# EAGLE design OnOfre_2ADSP (EAGLE 8.6.0)
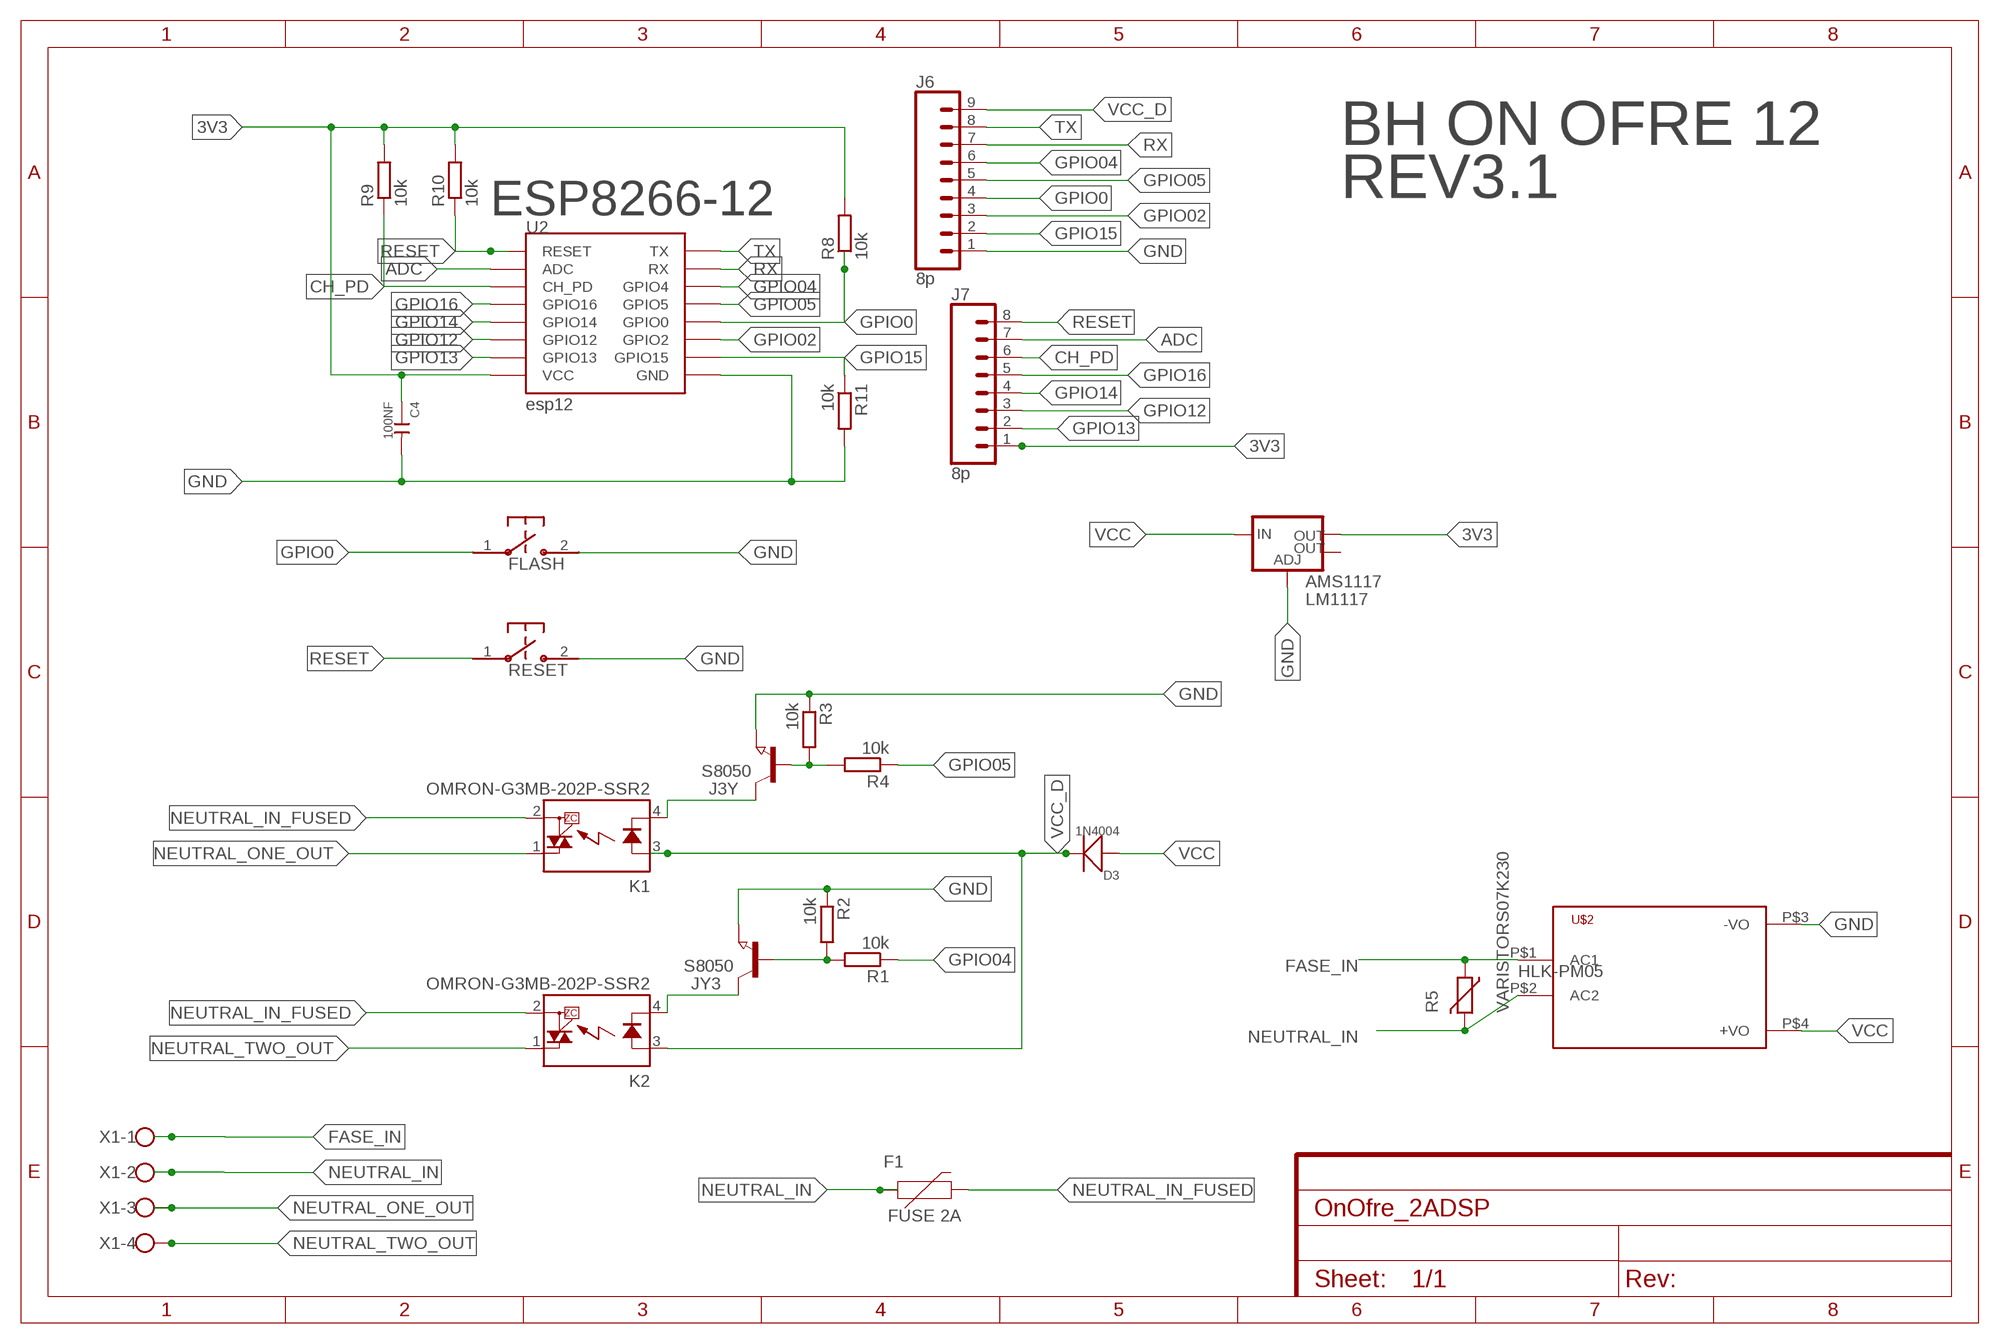
[diagram p0: schematic, sheet 1]

## Parts
AMS1117  LM1117  V_REG_LM1117SOT223  [SOT223]
C4  100NF  CERAMIC-1NF-1KV-10%-X7R(1206)  [C1206]
D3  1N4004  DIODE-GEN-PURPOSE-1KV-1A(DO-214AC)  [DO-214AC]
F1  FUSE 2A  PPTC_PTH  [PTH]
FLASH  B3U-1000P-2P-SMD  B3U-1000P  [B3U-1000P]
J3Y  S8050  NPN-TRANSISTOR_SOT23  [SOT23]
J6  8p  CONN_09  [1X09]
J7  8p  CONN_08"  [1X08]
JY3  S8050  NPN-TRANSISTOR_SOT23  [SOT23]
K1  OMRON-G3MB-202P-SSR2  [OMRON-G3MB-202P-SSR]
K2  OMRON-G3MB-202P-SSR2  [OMRON-G3MB-202P-SSR]
R1  10k  R-EU_R0603  [R0603]
R2  10k  R-EU_R0603  [R0603]
R3  10k  R-EU_R0603  [R0603]
R4  10k  R-EU_R0603  [R0603]
R5  VARISTORS07K230  [S07K230]
R8  10k  R-EU_R0603  [R0603]
R9  10k  R-EU_R0603  [R0603]
R10  10k  R-EU_R0603  [R0603]
R11  10k  R-EU_R0603  [R0603]
RESET  B3U-1000P-2P-SMD  B3U-1000P  [B3U-1000P]
U2  esp12  ESP12SMD  [ESP12-SMD]
U$2  HKLPM01  [HKLPM01]
X1  W237-4  [W237-4]

## Nets
3V3: AMS1117.2(OUT) C4.1 J7.1 R8.2 R9.2 R10.2 U2.VCC
ADC: J7.7 U2.ADC
CH_PD: J7.6 R9.1 U2.CH_PD
FASE_IN [220V]: R5.1 U$2.P$1(AC1) X1.1
GND: AMS1117.1(ADJ) C4.2 FLASH.2 J3Y.2(E) J6.1 JY3.2(E) R2.1 R3.1 R11.2 RESET.2 U2.GND U$2.P$3(-VO)
GPIO0: FLASH.1 J6.4 R8.1 U2.GPIO0
GPIO02: J6.3 U2.GPIO2
GPIO04: J6.6 R1.1 U2.GPIO4
GPIO05: J6.5 R4.1 U2.GPIO5
GPIO12: J7.3 U2.GPIO12
GPIO13: J7.2 U2.GPIO13
GPIO14: J7.4 U2.GPIO14
GPIO15: J6.2 R11.1 U2.GPIO15
GPIO16: J7.5 U2.GPIO16
N$1: J3Y.3(C) K1.4(K)
N$7: J3Y.1(B) R3.2 R4.2
N$9: JY3.3(C) K2.4(K)
N$13: JY3.1(B) R1.2 R2.2
NEUTRAL_IN [220V]: F1.P$1 R5.2 U$2.P$2(AC2) X1.2
NEUTRAL_IN_FUSED: F1.P$2 K1.2(DS2) K2.2(DS2)
NEUTRAL_ONE_OUT [220V]: K1.1(DS1) X1.3
NEUTRAL_TWO_OUT [220V]: K2.1(DS1) X1.4
RESET: J7.8 R10.1 RESET.1 U2.RESET
RX: J6.7 U2.RXD0(RX)
TX: J6.8 U2.TXD0(TX)
VCC: AMS1117.3(IN) D3.1(+) U$2.P$4(+VO)
VCC_D: D3.2(-) J6.9 K1.3(A) K2.3(A)
Unconnected: AMS1117.4(OUT)

## Notes on the sheet
- BH ON OFRE 12
- REV3.1
- ESP8266-12
- HLK-PM05

## Library data of the parts
AMS1117 = SparkFun-IC-Power:V_REG_LM1117: Voltage Regulator LM1117 Standard adjustable voltage regulator but in SMD form. Spark Fun Electronics SKU : COM-00595; PROD_ID: VREG-08170
C4 = Seeed-Capacitor:CERAMIC-1NF-1KV-10%-X7R?(1206): 302010189; MPN: CC1206KKX7RCBB102; VALUE: 1NF
D3 = Seeed-Diode:DIODE-GEN-PURPOSE-1KV-1A(DO-214AC): 304010013; MPN: 1N4007; VALUE: 1N4007
F1 = SparkFun-Fuses:PPTC: Resettable Fuse PPTC Resettable Fuse. Really a sort of resistor with a polymeric positive temperature coefficient whose resistance increases dramatically with an increase in temperature. When heated by the power passing through the resistance rises causing the current to be limited, protecting the circuit. This is achieved by the transition of the polymer from a crystalline to an amorphous state where the conductive carbon separates breaking the conductive pathways found in the cool crystalline structure. When a PPTC cools back down it resumes conducting letting the circuit turn back on. SparkFun Products: SparkFun RedBoard - Programmed with Arduino <https://www.sparkfun.com/products/12757> Pro Micro - 5V/16MHz <https://www.sparkfun.com/products/12640> Arduino Pro 328 - 5V/16MHz <https://www.sparkfun.com/products/10915> MP3 Trigger <https://www.sparkfun.com/products/13720>; PROD_ID: RES-08490; VALUE: 72V/0.25A
FLASH = switches:B3U: Switch; DIGIKEY: SW1020CT-ND; MANUFACTURER: Omron; MPN: B3U-1000P; SPICEPREFIX: F
J3Y JY3 = semicon-smd-ipc:NPN-TRANSISTOR_: NPN TRANSISTOR
J6 = SparkFun-Connectors:CONN_09: Multi connection point. Often used as Generic Header-pin footprint for 0.1 inch spaced/style header connections On any of the 0.1 inch spaced packages, you can populate with these: Break Away Headers - Straight <https://www.sparkfun.com/products/116> (PRT-00116) Break Away Male Headers - Right Angle <https://www.sparkfun.com/products/553> (PRT-00553) Female Headers <https://www.sparkfun.com/products/115> (PRT-00115) Break Away Headers - Machine Pin <https://www.sparkfun.com/products/117> (PRT-00117) Break Away Female Headers - Swiss Machine Pin <https://www.sparkfun.com/products/743> (PRT-00743) For SCREWTERMINALS and SPRING TERMINALS visit here: Screw Terimnals on SparkFun.com <https://www.sparkfun.com/search/results?term=Screw+Terminals> (5mm/3.5mm/2.54mm spacing) This device is also useful as a general connection point to wire up your design to another part of your project. Our various solder wires solder well into these plated through hole pads. Hook-Up Wire - Assortment (Stranded, 22 AWG) <https://www.sparkfun.com/products/11375> (PRT-11375) Hook-Up Wire - Assortment (Solid Core, 22 AWG) <https://www.sparkfun.com/products/11367> (PRT-11367) View the entire wire category on our website here <https://www.sparkfun.com/categories/141> Special notes: Molex polarized connector foot print use with SKU : PRT-08231 with associated crimp pins and housings. 1MM SMD Version SKU: PRT-10208 NOTES ON THE VARIANTS LOCK and LOCK_LONGPADS... This footprint was designed to help hold the alignment of a through-hole component (i.e. 6-pin header) while soldering it into place. You may notice that each hole has been shifted either up or down by 0.005 of an inch from it's more standard position (which is a perfectly straight line). This slight alteration caused the pins (the squares in the middle) to touch the edges of the holes. Because they are alternating, it causes a "brace" to hold the component in place. 0.005 has proven to be the perfect amount of "off-center" position when using our standard breakaway headers. Although looks a little odd when you look at the bare footprint, once you have a header in there, the alteration is very hard to notice. Also,if you push a header all the way into place, it is covered up entirely on the bottom side.
J7 = SparkFun-Connectors:CONN_08: Multi connection point. Often used as Generic Header-pin footprint for 0.1 inch spaced/style header connections On any of the 0.1 inch spaced packages, you can populate with these: Break Away Headers - Straight <https://www.sparkfun.com/products/116> (PRT-00116) Break Away Male Headers - Right Angle <https://www.sparkfun.com/products/553> (PRT-00553) Female Headers <https://www.sparkfun.com/products/115> (PRT-00115) Break Away Headers - Machine Pin <https://www.sparkfun.com/products/117> (PRT-00117) Break Away Female Headers - Swiss Machine Pin <https://www.sparkfun.com/products/743> (PRT-00743) Arduino Stackable Header - 8 Pin <https://www.sparkfun.com/products/9279> (PRT-09279) For SCREWTERMINALS and SPRING TERMINALS visit here: Screw Terimnals on SparkFun.com <https://www.sparkfun.com/search/results?term=Screw+Terminals> (5mm/3.5mm/2.54mm spacing) This device is also useful as a general connection point to wire up your design to another part of your project. Our various solder wires solder well into these plated through hole pads. Hook-Up Wire - Assortment (Stranded, 22 AWG) <https://www.sparkfun.com/products/11375> (PRT-11375) Hook-Up Wire - Assortment (Solid Core, 22 AWG) <https://www.sparkfun.com/products/11367> (PRT-11367) View the entire wire category on our website here <https://www.sparkfun.com/categories/141> Special notes: Molex polarized connector foot print use with SKU : PRT-08231 with associated crimp pins and housings. 1MM SMD Version SKU: PRT-10208 NOTES ON THE VARIANTS LOCK and LOCK_LONGPADS... This footprint was designed to help hold the alignment of a through-hole component (i.e. 6-pin header) while soldering it into place. You may notice that each hole has been shifted either up or down by 0.005 of an inch from it's more standard position (which is a perfectly straight line). This slight alteration caused the pins (the squares in the middle) to touch the edges of the holes. Because they are alternating, it causes a "brace" to hold the component in place. 0.005 has proven to be the perfect amount of "off-center" position when using our standard breakaway headers. Although looks a little odd when you look at the bare footprint, once you have a header in there, the alteration is very hard to notice. Also,if you push a header all the way into place, it is covered up entirely on the bottom side.; PROD_ID: CONN-08438
K1 K2 = Omron G3MB 202p SSR:OMRON-G3MB-202P-SSR: IT(rms) 8A, Zero Cross type SIP 4pin Triac output SSR Source: http://sharp-world.com/products/device/lineup/data/pdf/datasheet/s102s02_e.pdf; MPN: S202S02F; OC_FARNELL: 1618475; OC_NEWARK: 14N9588
R1-R4 R8-R11 = resistor:R-EU_: RESISTOR, European symbol
R5 = varistor:VARISTOR: VARISTOR
RESET = switches:B3U: Switch; DIGIKEY: SW1020CT-ND; MANUFACTURER: Omron; MPN: B3U-1000P
U2 = esp8266modules:ESP12: ESP8266 Wifi module 12
U$2 = HKLPM01:HKLPM01
X1 = con-wago-500:W237-4: WAGO SCREW CLAMP; OC_FARNELL: unknown; OC_NEWARK: unknown

## Net classes
1 220V: width 1.27 mm, clearance 2 mm

## Board
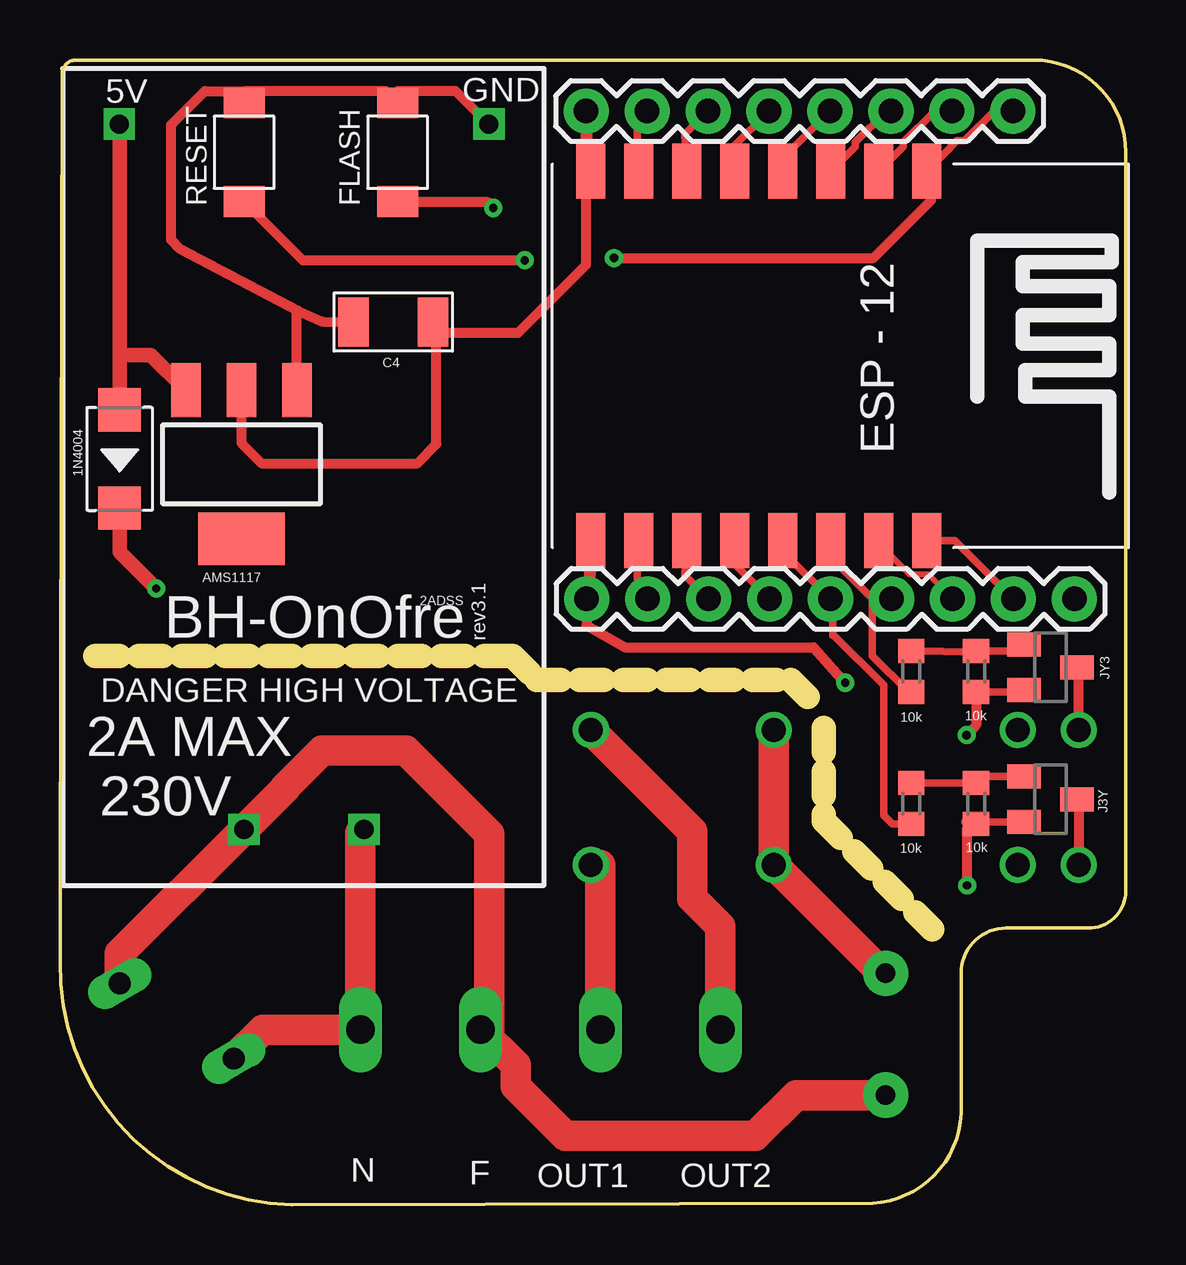
[diagram p1: board, top side]
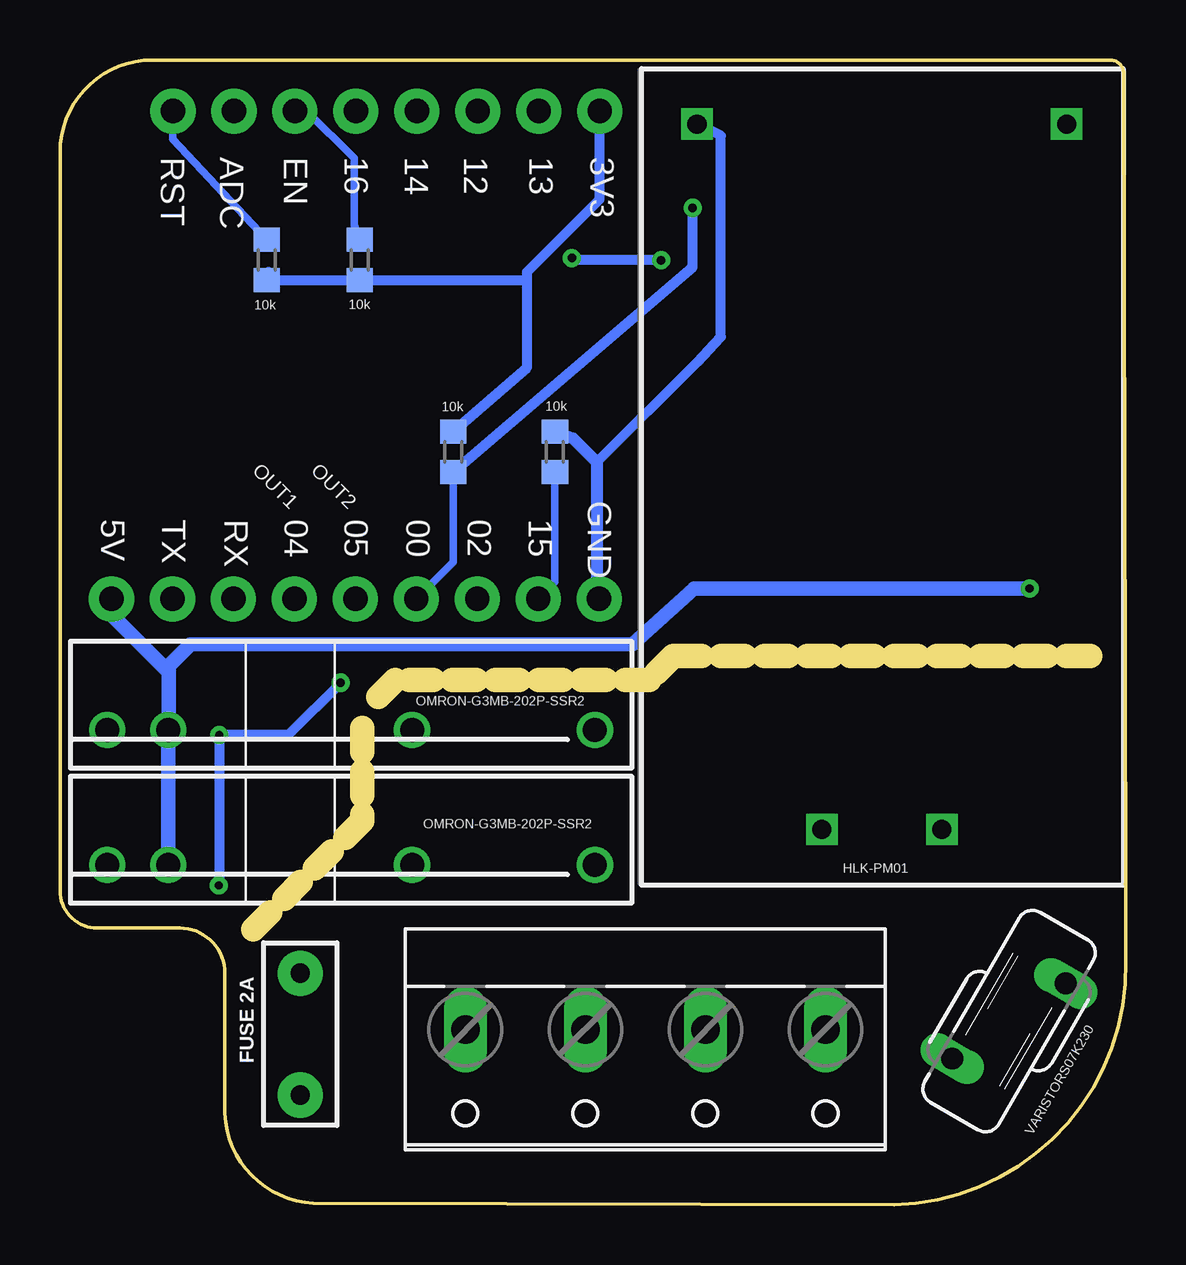
[diagram p2: board, bottom side, seen from below]

Size 44.41 x 47.73 mm. Coordinates in mm from the lower left corner, seen from the top.
Outline: 0.01,13.43 0.01,13.34
Outline: 0.01,13.34 0.01,10.14 arc90 9.66,0 33.86,0.08 arc90 37.54,4.17 37.54,9.66 arc-90 39.42,11.54 42.86,11.54 arc90 44.41,13.1 44.41,43.89 arc90 40.57,47.73 0.67,47.73 arc90 0.09,47.16 0,13.43 arc-90 0.01,13.34
Copper layers (1*16): Top 0.035mm / dielectric 1.5mm / Bottom 0.035mm
Design rules "default": minimum track width 6mil, minimum drill 0.35mm, track to track 6mil, track to pad 6mil, pad to pad 6mil, via to via 6mil, smd to smd 6mil, copper to edge 40mil, drill to drill 6mil, minimum pad ring 10mil, minimum via ring 8mil, stop-mask expansion 4mil, vias tented up to drill 0mil, thermal gap 10mil
Milling: 25 lines

### Footprints (pad centres in the part's own frame; a part is rotated, then mirrored left to right if it is on the bottom)
SOT223 = smd 1.219 x 2.235: 1 -2.311,-3.099; 2 0,-3.099; 3 2.311,-3.099 | smd 3.6 x 2.2: 4 0,3.099
C1206 = smd 1.27 x 2.032: 1 -1.651,0; 2 1.651,0
DO-214AC = smd 1.8 x 1.77: 1 -2.042,0; 2 2.042,0
PTH = drill 0.8 pad 1.88: P$1 -2.54,0; P$2 2.54,0
B3U-1000P = smd 1.283 x 1.7: 1 -2.056,0; 2 2.056,0
SOT23 = smd 1 x 1.4: 1 -0.95,-1.1; 2 0.95,-1.1; 3 0,1.1
1X09 = drill 1.016 pad 1.88: 1 0,0; 2 2.54,0; 3 5.08,0; 4 7.62,0; 5 10.16,0; 6 12.7,0; 7 15.24,0; 8 17.78,0; 9 20.32,0
1X08 = drill 1.016 pad 1.88: 1 0,0; 2 2.54,0; 3 5.08,0; 4 7.62,0; 5 10.16,0; 6 12.7,0; 7 15.24,0; 8 17.78,0
OMRON-G3MB-202P-SSR = drill 1: 1 -12.7,0; 2 -5.08,0; 3 5.08,0; 4 7.62,0
R0603 = smd 1 x 1.1: 1 -0.85,0; 2 0.85,0
S07K230 = drill 0.914 long: 1 -1.27,-2.54; 2 1.27,2.54
ESP12-SMD = smd 2.286 x 1.2: ADC -7.792,3.8; CH_PD -7.792,1.8; GND 7.592,-8.2; GPIO0 7.592,-2.2; GPIO2 7.592,-4.2; GPIO4 7.592,1.8; GPIO5 7.592,-0.2; GPIO12 -7.792,-4.2; GPIO13 -7.792,-6.2; GPIO14 -7.792,-2.2; GPIO15 7.592,-6.2; GPIO16 -7.792,-0.2; RESET -7.792,5.8; RXD0 7.592,3.8; TXD0 7.592,5.8; VCC -7.792,-8.2
HKLPM01 = drill 0.8 square: P$1 -14.7,2.5; P$2 -14.7,-2.5; P$3 14.7,7.7; P$4 14.7,-7.7
W237-4 = drill 1.194 long: 1 -7.5,-1.27; 2 -2.5,-1.27; 3 2.5,-1.27; 4 7.5,-1.27

### Placement (x,y rotation side)
AMS1117  7.56,30.87 180 top
C4  13.89,36.81 180 top
D3  2.48,31.1 270 top
F1  34.4,7.12 90 bottom
FLASH  14.07,43.88 90 top
J3Y  41.27,16.91 270 top
J6  21.95,25.26 0 top
J7  21.92,45.6 0 top
JY3  41.27,22.41 270 top
K1  34.82,14.18 180 bottom
K2  34.82,19.8 180 bottom
R1  35.47,22.23 90 top
R2  38.17,22.23 90 top
R3  38.17,16.73 90 top
R4  35.47,16.73 90 top
R5  4.87,7.67 330 bottom
R8  28.03,31.39 90 bottom
R9  31.92,39.39 270 bottom
R10  35.8,39.39 270 bottom
R11  23.79,31.39 90 bottom
RESET  7.67,43.88 90 top
U2  30.32,35.3 270 top
U$2  10.17,30.35 90 bottom
X1  20.02,6.04 180 bottom

### Tracks (layer width: path | path; a pad name or v marks a point on that pad's centre or on a via)
3V3
  Top 0.406: J7.1 21.92,39.19 19.09,36.36 15.99,36.36 C4.1 15.69,36.66 15.69,31.72 14.88,30.91 8.42,30.91 7.56,31.76 AMS1117.2
  Top 0.508: J7.1 21.92,43.14 U2.VCC
  Bottom 0.406: R8.2 24.95,34.91 24.95,38.51 | 24.95,38.51 24.95,38.9 21.92,41.92 J7.1 | 35.72,38.9 R10.2 R9.2 24.98,38.54 24.95,38.51
ADC
  Top 0.305: U2.ADC 35.13,44.12 35.13,44.3 36.44,45.6 J7.7
CH_PD
  Top 0.305: U2.CH_PD 33.13,44.12 33.13,44.3 34.44,45.6 J7.6
  Bottom 0.305: R9.1 32.15,40.83 32.15,43.63 34.12,45.6 J7.6
FASE_IN
  Top 1.27: U$2.P$1 12.52,15.5 X1.1 8.44,7.31 R5.1
GND  (via drill 0.35)
  Top 0.305: R2.1 40.3,21.38 JY3.2 | 37.71,15.96 R3.1 38.09,15.96 J3Y.2
  Top 0.406: 8.07,45.63 RESET.2 7.67,46.38 7.73,46.43 | 17.4,45.52 U$2.P$3 16.49,46.43 14.08,46.43 14.08,45.95 FLASH.2 13.57,46.43 7.73,46.43 | R2.1 38.17,19.99 v37.78,19.59 | v37.8,13.32 37.8,15.67 R3.1 | J6.1 21.95,24.16 23.55,23.24 31.4,23.24 v32.72,21.77 | 9.95,37.27 4.96,39.89 4.63,40.22 4.63,45.03 6.04,46.43 7.73,46.43 | 9.95,37.27 10.92,36.83 C4.2 | AMS1117.1 9.87,37.19 9.95,37.27
  Top 0.508: U2.GND 22.04,25.36 J6.1
  Bottom 0.406: v37.8,13.32 37.78,13.34 v37.78,19.59 34.9,19.59 v32.72,21.77 | 22.04,30.96 17.87,35.13 16.88,36.19 16.88,44.57 U$2.P$3
  Bottom 0.508: R11.2 23.04,31.96 22.04,30.96 22.04,25.36 J6.1
GPIO0  (via drill 0.35)
  Top 0.305: J6.4 28.04,26.79 U2.GPIO0
  Top 0.406: FLASH.1 17.79,41.82 v18.05,41.56
  Bottom 0.305: R8.1 28.03,26.8 J6.4
  Bottom 0.406: R8.1 18.05,39.09 v18.05,41.56
GPIO02
  Top 0.305: J6.3 26.04,26.25 U2.GPIO2
GPIO04
  Top 0.305: J6.6 33.87,25.26 33.84,25.29 | U2.GPIO4 32.04,27.09 33.84,25.29 | R1.1 35.38,21.36 33.84,22.89 33.84,25.29
GPIO05
  Top 0.305: U2.GPIO5 30.04,27.33 J6.5 32.2,25.17 32.2,23.75 32.25,23.75 34.32,21.68 34.32,16.24 34.67,15.88 R4.1
GPIO12
  Top 0.305: U2.GPIO12 26.04,44.64 J7.3
GPIO13
  Top 0.305: U2.GPIO13 24.04,45.18 J7.2
GPIO14
  Top 0.305: U2.GPIO14 28.04,44.1 J7.4
GPIO15
  Top 0.305: U2.GPIO15 24.04,25.71 J6.2
  Bottom 0.305: R11.1 23.79,25.96 J6.2
GPIO16
  Top 0.305: U2.GPIO16 30.04,43.56 J7.5
N$1
  Top 0.406: J3Y.3 42.44,16.84 K1.4
N$7
  Top 0.305: J3Y.1 38.29,17.86 38.18,17.75 R3.2 R4.2
N$9
  Top 0.406: K2.4 42.44,22.34 JY3.3
N$13
  Top 0.305: R1.2 38.15,23.06 R2.2 40.1,23.08 JY3.1
NEUTRAL_IN
  Top 1.27: R5.2 2.5,10.48 U$2.P$2 9.38,17.37 9.38,17.4 10.92,18.94 14.41,18.94 17.89,15.47 17.89,7.31 X1.2 18.99,5.84 18.99,4.95 21.05,2.88 28.98,2.88 30.68,4.58 F1.P$1
NEUTRAL_IN_FUSED
  Top 1.27: K2.2 K1.2 | K1.2 | K1.2 34.26,9.66 F1.P$2
NEUTRAL_ONE_OUT
  Top 1.27: X1.3 22.52,14.18 K1.1
NEUTRAL_TWO_OUT
  Top 1.27: X1.4 27.52,11.61 26.35,12.77 26.35,15.57 K2.1
RESET  (via drill 0.35)
  Top 0.305: U2.RESET 36.3,43.27 37.37,44.36 37.68,44.36 38.92,45.6 J7.8
  Top 0.406: v23.08,39.47 33.89,39.47 36.3,41.88 36.3,43.27 | RESET.1 10.12,39.38 v19.37,39.38
  Bottom 0.305: R10.1 39.7,44.42 J7.8
  Bottom 0.406: v19.37,39.38 22.99,39.38 v23.08,39.47
RX
  Top 0.254: J6.7 36.17,26.28 35.4,26.28 34.59,27.1 34.05,27.1 34.05,27.64 U2.RXD0
TX
  Top 0.305: U2.TXD0 37.29,27.7 J6.8
VCC
  Top 0.61: D3.1 2.48,35.43 | 2.48,35.43 2.48,45.04 U$2.P$4 | 2.48,35.43 3.79,35.43 AMS1117.3
VCC_D  (via drill 0.35)
  Top 0.61: D3.2 2.48,27.22 v4.01,25.7
  Bottom 0.61: v4.01,25.7 17.98,25.7 20.56,23.39 38.98,23.37 39.89,22.46 39.89,22.22 | 39.89,22.22 39.89,19.82 K2.3 K1.3 | K1.3 | 39.89,22.22 42.27,24.6 J6.9

### Text on the board
tNames: 5V | GND | 2ADSS | BH-OnOfre | rev3.1 | DANGER HIGH VOLTAGE | 2A MAX | 230V | N | OUT1 | F | OUT2
bNames: 3V3 | 13 | 12 | 14 | 16 | EN | ADC | RST | GND | OUT2 | OUT1 | 15 | 02 | 00 | 05 | 04 | RX | TX | 5V | HLK-PM01